# EAGLE schematic OwlClock (EAGLE 7.5.0)
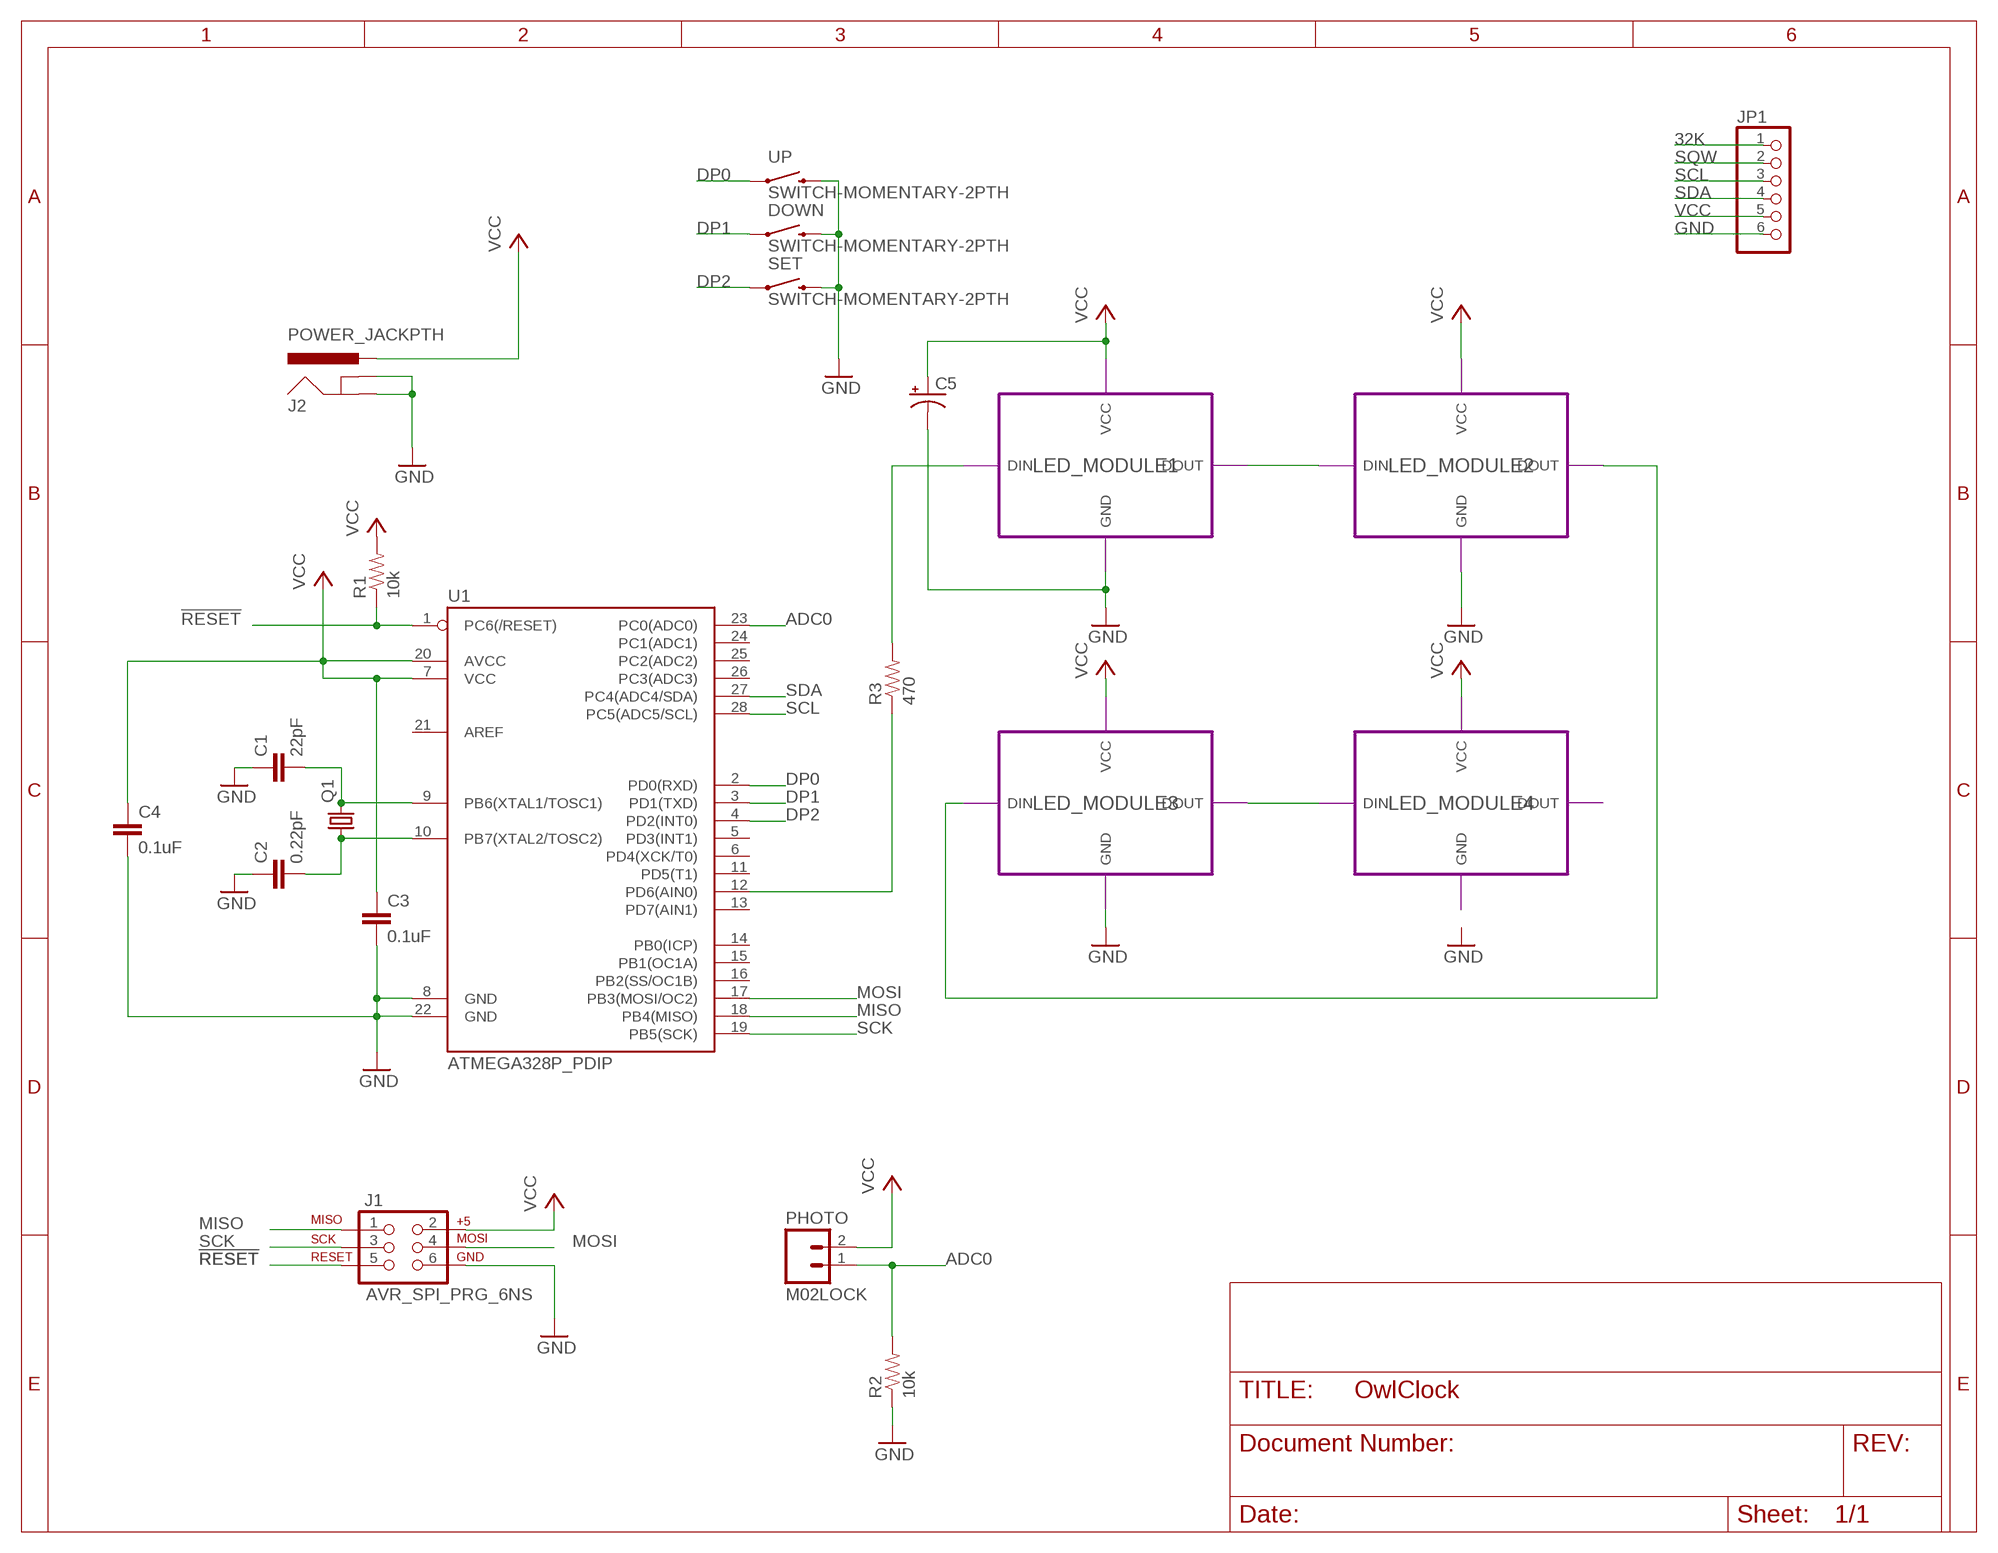
[diagram p0: schematic, sheet 1]

## Parts
C1  22pF  0.1UF-25V(+80/-20%)(0603)  [0603-CAP]
C2  0.22pF  0.1UF-25V(+80/-20%)(0603)  [0603-CAP]
C3  0.1uF  0.1UF-25V(+80/-20%)(0603)  [0603-CAP]
C4  0.1uF  0.1UF-25V(+80/-20%)(0603)  [0603-CAP]
C5  CAP_POLPTH4  [CPOL-RADIAL-1000UF-25V]
DOWN  SWITCH-MOMENTARY-2PTH  [TACTILE-PTH]
J1  AVR_SPI_PRG_6NS  [2X3-NS]
J2  POWER_JACKPTH  [POWER_JACK_PTH]
JP1  PINHD-1X6  [1X06]
PHOTO  M02LOCK  [1X02_LOCK]
Q1  CRYSTALHC18U-V  [HC18U-V]
R1  10k  0.22OHM1/4W1%(0805)  [0805]
R2  10k  0.22OHM1/4W1%(0805)  [0805]
R3  470  0.22OHM1/4W1%(0805)  [0805]
SET  SWITCH-MOMENTARY-2PTH  [TACTILE-PTH]
U1  ATMEGA328P_PDIP  [DIL28-3]
UP  SWITCH-MOMENTARY-2PTH  [TACTILE-PTH]

## Module instances
LED_MODULE1 = LED_MODULE
LED_MODULE2 = LED_MODULE
LED_MODULE3 = LED_MODULE
LED_MODULE4 = LED_MODULE

## Nets
32K: JP1.1
!RESET: J1.5 R1.1 U1.1(PC6(/RESET))
ADC0: PHOTO.1 R2.2 U1.23(PC0(ADC0))
DP0: U1.2(PD0(RXD)) UP.1
DP1: DOWN.1 U1.3(PD1(TXD))
DP2: SET.1 U1.4(PD2(INT0))
GND: C1.1 C2.1 C3.2 C4.2 C5.2(-) DOWN.3 J1.6 J2.GND J2.GNDBREAK JP1.6 R2.1 SET.3 U1.8(GND) U1.22(GND) UP.3 ; port LED_MODULE1.GND LED_MODULE2.GND LED_MODULE3.GND
MISO: J1.1 U1.18(PB4(MISO))
MOSI: J1.4 U1.17(PB3(MOSI/OC2))
N$1: port LED_MODULE2.DIN LED_MODULE1.DOUT
N$2: R3.1 U1.12(PD6(AIN0))
N$3: port LED_MODULE2.DOUT LED_MODULE3.DIN
N$4: port LED_MODULE3.DOUT LED_MODULE4.DIN
N$5: R3.2 ; port LED_MODULE1.DIN
N$17: C1.2 Q1.2 U1.9(PB6(XTAL1/TOSC1))
N$18: C2.2 Q1.1 U1.10(PB7(XTAL2/TOSC2))
PC0: PHOTO.2 ; supply symbol labelled VCC
SCK: J1.3 U1.19(PB5(SCK))
SCL: JP1.3 U1.28(PC5(ADC5/SCL))
SDA: JP1.4 U1.27(PC4(ADC4/SDA))
SQW: JP1.2
VCC: C3.1 C4.1 C5.1(+) J1.2 J2.PWR JP1.5 R1.2 U1.7(VCC) U1.20(AVCC) ; port LED_MODULE1.VCC LED_MODULE2.VCC LED_MODULE3.VCC LED_MODULE4.VCC
Unconnected: U1.5(PD3(INT1)) U1.6(PD4(XCK/T0)) U1.11(PD5(T1)) U1.13(PD7(AIN1)) U1.14(PB0(ICP)) U1.15(PB1(OC1A)) U1.16(PB2(SS/OC1B)) U1.21(AREF) U1.24(PC1(ADC1)) U1.25(PC2(ADC2)) U1.26(PC3(ADC3))

## Library data of the parts
C1 C2 = SparkFun-Capacitors:0.1UF-25V(+80/-20%)(0603): CAP-00810 Ceramic Standard decoupling cap; PROD_ID: CAP-00810; VALUE: 0.1uF
C3 C4 = SparkFun-Capacitors:0.1UF-25V(+80/-20%)(0603): CAP-00810 Ceramic Standard decoupling cap; PROD_ID: CAP-00810
C5 = SparkFun-Capacitors:CAP_POL: Capacitor Polarized These are standard SMD and PTH capacitors. Normally 10uF, 47uF, and 100uF in electrolytic and tantalum varieties. Always verify the external diameter of the through hole cap, it varies with capacity, voltage, and manufacturer. The EIA devices should be standard.
DOWN SET UP = SparkFun-Electromechanical:SWITCH-MOMENTARY-2: Various NO switches- pushbuttons, reed, etc
J1 = SparkFun-Connectors:AVR_SPI_PRG_6: AVR ISP 6 Pin This is the reduced ISP connector for AVR programming. Common on Arduino. This footprint will take up less PCB space and can be used with a 10-pin to 6-pin adapter such as SKU: BOB-08508 **Special note about "TEST_POINT" package. The stop mask is on the top side, so if you want your programming test points to be on the bottom of your board, make sure to place this package on the bottom side of the board. This also ensure that the orientation to program from the bottom side will be correct.
J2 = SparkFun-Connectors:POWER_JACK: Power Jack This is the standard 5.5mm barrel jack for power. The PTH is the most common, proven, reliable, footprint. The Slot footprint only works if the mill layer is transmitted to the PCB fab house so be warned. Mating wall wart : TOL-00298 (and others); PROD_ID: PRT-00119
JP1 = adafruit:PINHD-1X6: PIN HEADER
PHOTO = SparkFun-Connectors:M02: Standard 2-pin 0.1" header. Use with - straight break away headers ( PRT-00116) - right angle break away headers (PRT-00553) - swiss pins (PRT-00743) - machine pins (PRT-00117) - female headers (PRT-00115) Molex polarized connector foot print use with: PRT-08233 with associated crimp pins and housings. 2.54_SCREWTERM for use with PRT-10571. 3.5mm Screw Terminal footprints for PRT-08084 5mm Screw Terminal footprints for use with PRT-08433
Q1 = adafruit:CRYSTAL: CRYSTAL; OC_FARNELL: unknown; OC_NEWARK: unknown
R1-R3 = SparkFun-Resistors:0.22OHM1/4W1%(0805): RES-09883; PROD_ID: RES-09883; VALUE: 0.22
U1 = SparkFun-DigitalIC:ATMEGA328P_PDIP: uC used in the Arduino 32kb flash, 1k EEPROM, 2k SRAM This is the through-hole version of this chip.

## Module LED_MODULE
Ports: GND(io) DIN(io) DOUT(io) VCC(io)
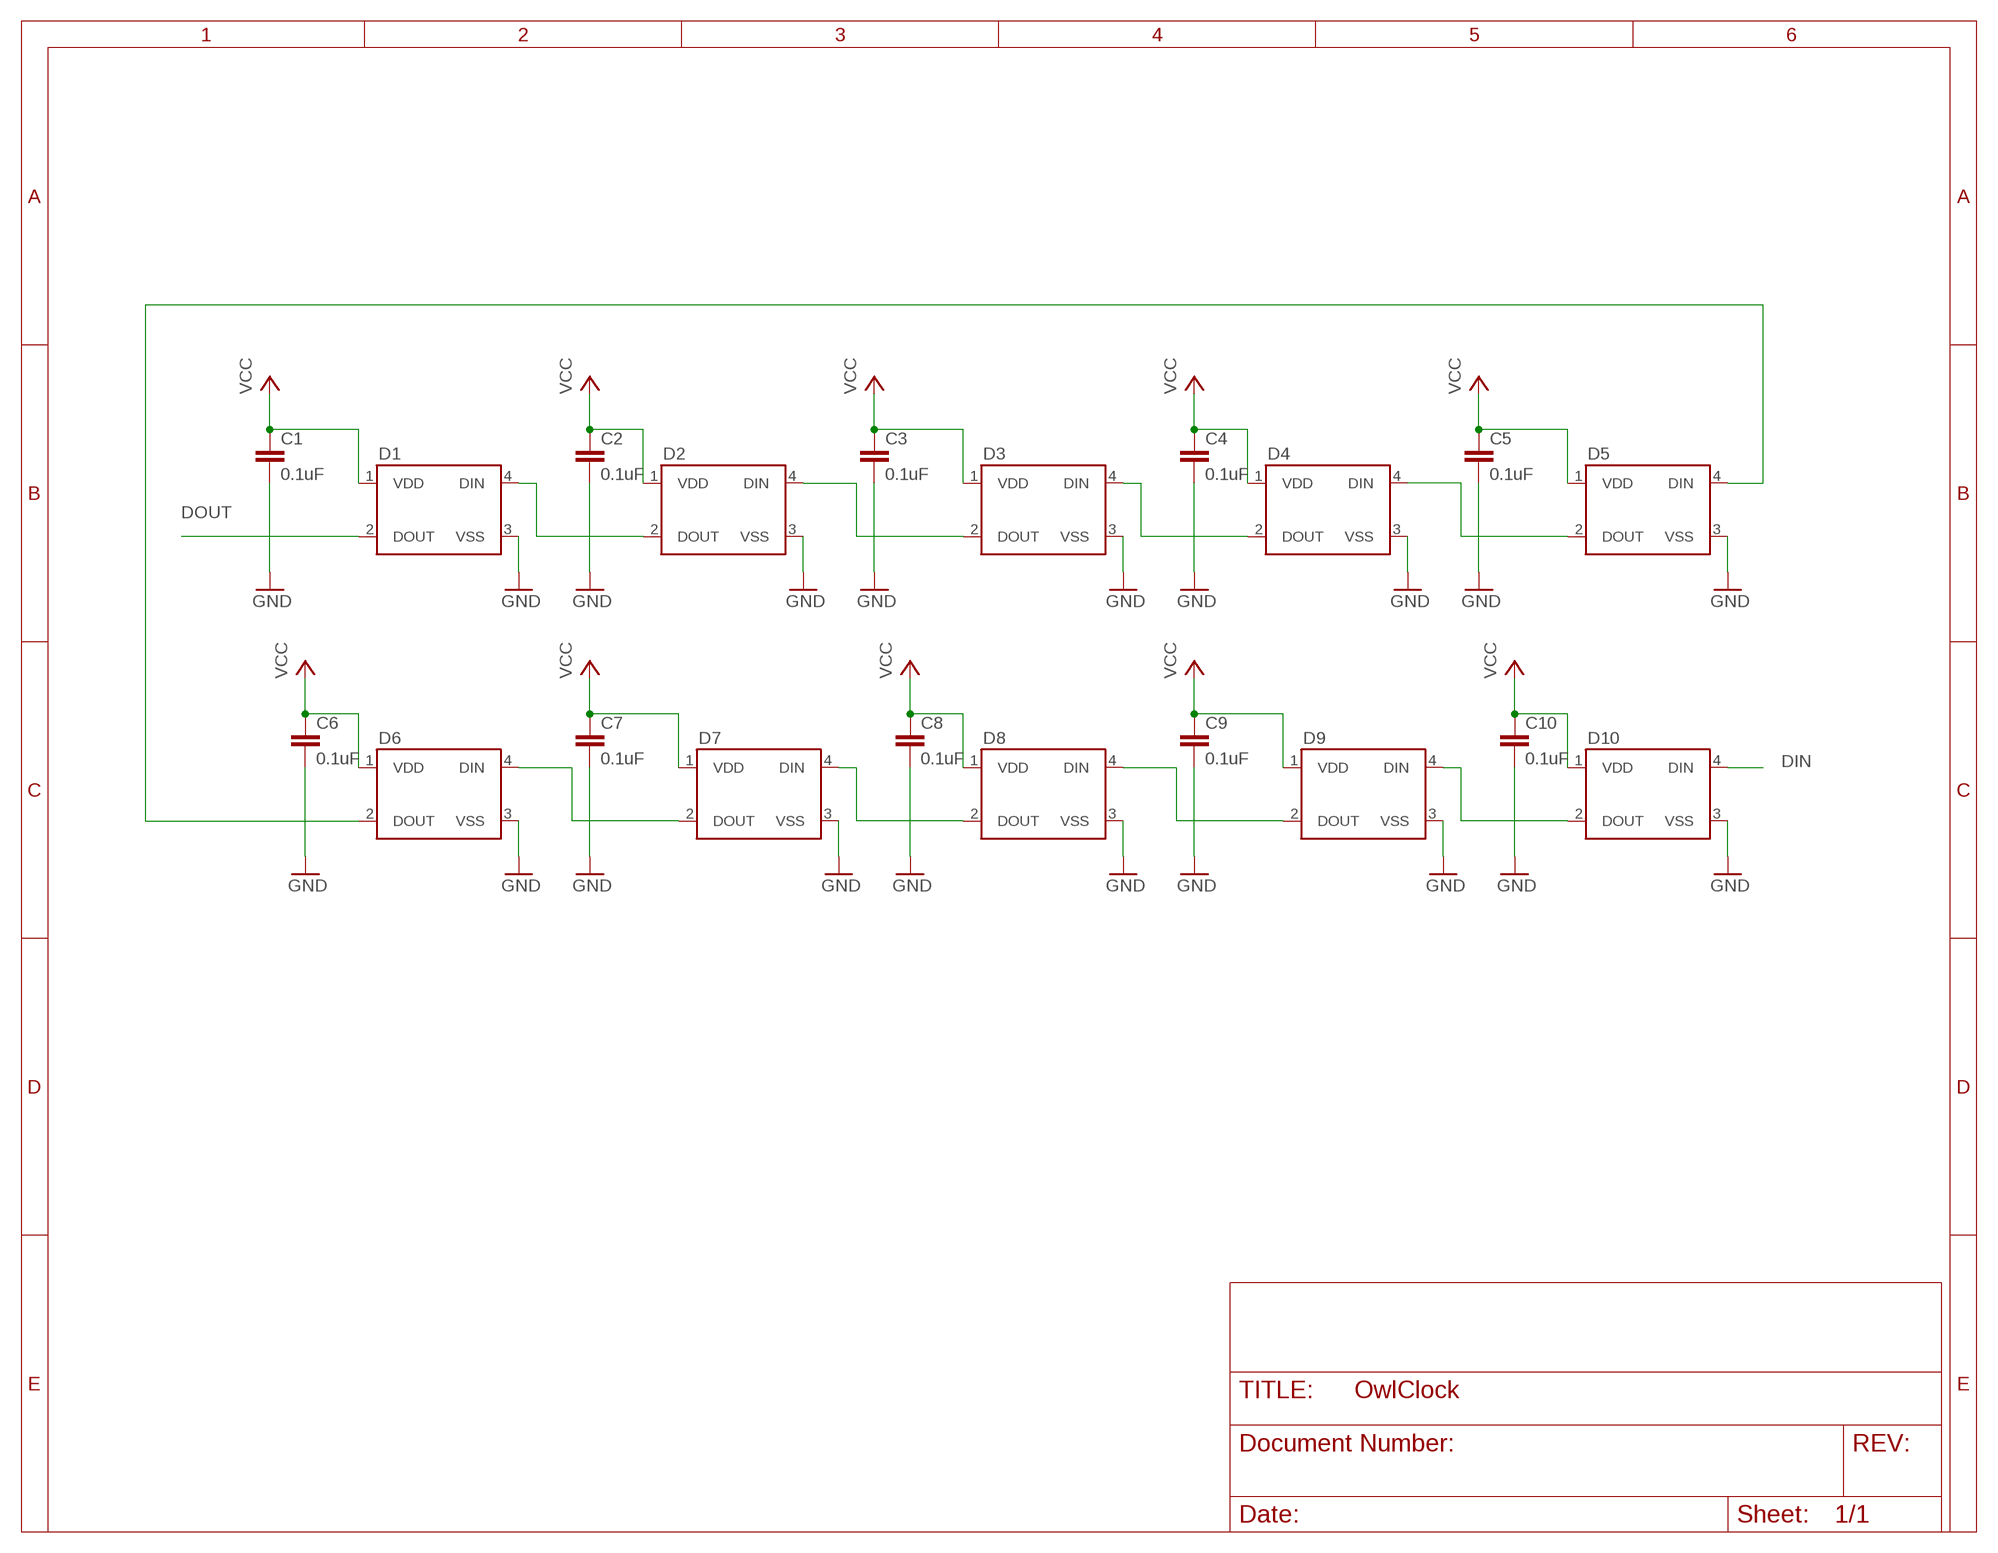
[diagram p1: schematic, module LED_MODULE, sheet 1]

### Parts
C1  0.1uF  0.1UF-25V(+80/-20%)(0603)  [0603-CAP]
C2  0.1uF  0.1UF-25V(+80/-20%)(0603)  [0603-CAP]
C3  0.1uF  0.1UF-25V(+80/-20%)(0603)  [0603-CAP]
C4  0.1uF  0.1UF-25V(+80/-20%)(0603)  [0603-CAP]
C5  0.1uF  0.1UF-25V(+80/-20%)(0603)  [0603-CAP]
C6  0.1uF  0.1UF-25V(+80/-20%)(0603)  [0603-CAP]
C7  0.1uF  0.1UF-25V(+80/-20%)(0603)  [0603-CAP]
C8  0.1uF  0.1UF-25V(+80/-20%)(0603)  [0603-CAP]
C9  0.1uF  0.1UF-25V(+80/-20%)(0603)  [0603-CAP]
C10  0.1uF  0.1UF-25V(+80/-20%)(0603)  [0603-CAP]
D1  WS2812B  [WS2812B]
D2  WS2812B  [WS2812B]
D3  WS2812B  [WS2812B]
D4  WS2812B  [WS2812B]
D5  WS2812B  [WS2812B]
D6  WS2812B  [WS2812B]
D7  WS2812B  [WS2812B]
D8  WS2812B  [WS2812B]
D9  WS2812B  [WS2812B]
D10  WS2812B  [WS2812B]

### Nets
DIN: D10.4(DIN)
DOUT: D1.2(DOUT)
GND: C1.2 C2.2 C3.2 C4.2 C5.2 C6.2 C7.2 C8.2 C9.2 C10.2 D1.3(VSS) D2.3(VSS) D3.3(VSS) D4.3(VSS) D5.3(VSS) D6.3(VSS) D7.3(VSS) D8.3(VSS) D9.3(VSS) D10.3(VSS)
N$1: D2.4(DIN) D3.2(DOUT)
N$5: D1.4(DIN) D2.2(DOUT)
N$6: D3.4(DIN) D4.2(DOUT)
N$7: D4.4(DIN) D5.2(DOUT)
N$9: D5.4(DIN) D6.2(DOUT)
N$10: D6.4(DIN) D7.2(DOUT)
N$12: D7.4(DIN) D8.2(DOUT)
N$13: D8.4(DIN) D9.2(DOUT)
N$15: D9.4(DIN) D10.2(DOUT)
VCC: C1.1 C2.1 C3.1 C4.1 C5.1 C6.1 C7.1 C8.1 C9.1 C10.1 D1.1(VDD) D2.1(VDD) D3.1(VDD) D4.1(VDD) D5.1(VDD) D6.1(VDD) D7.1(VDD) D8.1(VDD) D9.1(VDD) D10.1(VDD)

### Library data of the parts
C1-C10 = SparkFun-Capacitors:0.1UF-25V(+80/-20%)(0603): CAP-00810 Ceramic Standard decoupling cap; PROD_ID: CAP-00810
D1-D10 = SparkFun-LED:WS2812B: WS2812B - Intelligent control LED integrated light source Technical Specifications: Power Supply Voltage (VDD): 3.5 to 5.3 V Input Voltage (VI): -0.5 to VDD+0.5 V Operating Junction Temperature (Topt): -25°C to +80°C Storage Temperature Range (Tstg): -55°C to +150°C